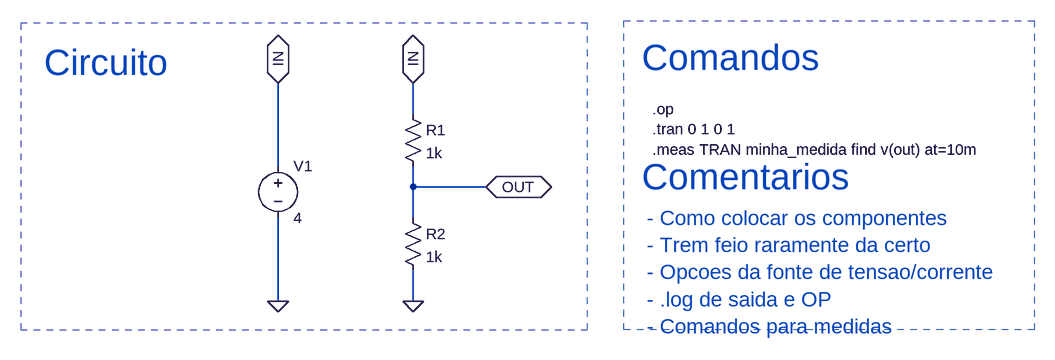
[diagram p0: schematic 2_op_e_tran.asc]
2_op_e_tran.asc, the LTspice schematic file:
Version 4
SHEET 1 1288 680
WIRE 320 240 320 192
WIRE 112 320 112 192
WIRE 320 352 320 320
WIRE 432 352 320 352
WIRE 320 400 320 352
WIRE 112 528 112 400
WIRE 320 528 320 480
FLAG 112 192 IN
IOPIN 112 192 BiDir
FLAG 112 528 0
FLAG 320 528 0
FLAG 320 192 IN
IOPIN 320 192 BiDir
FLAG 432 352 OUT
IOPIN 432 352 BiDir
SYMBOL voltage 112 304 R0
SYMATTR InstName V1
SYMATTR Value 4
SYMBOL res 304 224 R0
SYMATTR InstName R1
SYMATTR Value 1k
SYMBOL res 304 384 R0
SYMATTR InstName R2
SYMATTR Value 1k
TEXT 680 400 Left 3 ;- Como colocar os componentes\n- Trem feio raramente da certo\n- Opcoes da fonte de tensao/corrente\n- .log de saida e OP\n- Comandos para medidas
TEXT 672 152 Left 5 ;Comandos
TEXT 672 336 Left 5 ;Comentarios
TEXT -248 160 Left 5 ;Circuito
TEXT 688 232 Left 2 !.op\n.tran 0 1 0 1\n.meas TRAN minha_medida find v(out) at=10m
RECTANGLE Normal 644 96 1276 572 2
RECTANGLE Normal 588 100 -284 572 2

The netlist it stands for:
* 2_op_e_tran.asc
V1 IN 0 4
R1 IN OUT 1k
R2 OUT 0 1k
* - Como colocar os componentes
* - Trem feio raramente da certo
* - Opcoes da fonte de tensao/corrente
* - .log de saida e OP
* - Comandos para medidas
* Comandos
* Comentarios
* Circuito
.op
.tran 0 1 0 1
.meas TRAN minha_medida find v(out) at=10m
.backanno
.end